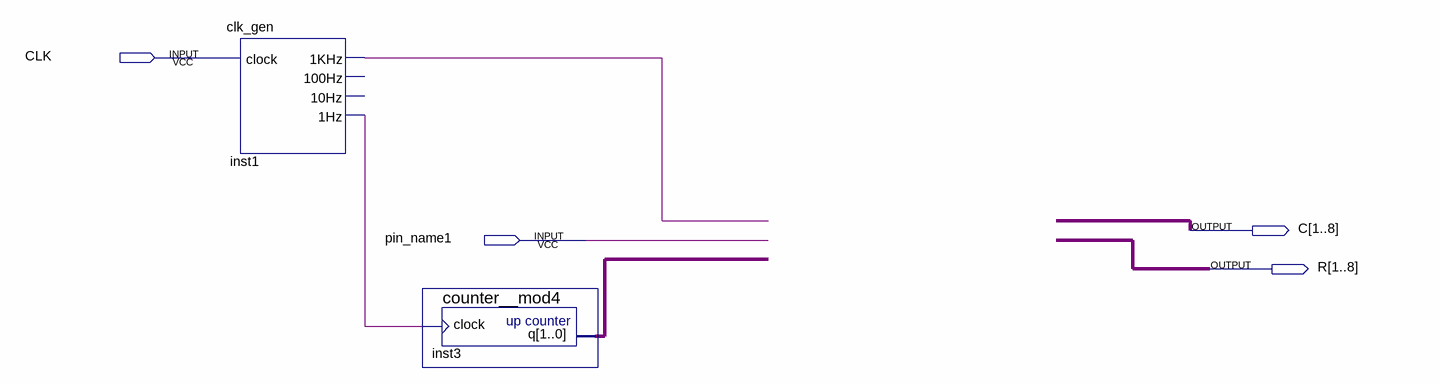
[diagram p0: schematic sheet]
// Quartus schematic test.bdf as structural Verilog: 2 symbols, 4 pins
module test (
  input  CLK,
  input  pin_name1,
  output [1:8] C,
  output [1:8] R
);

  wire inst1_1hz, inst1_1khz;
  wire [1:0] inst3_q;

  clk_gen inst1 (.clock(CLK), .\1KHz (inst1_1khz), .\1Hz (inst1_1hz));  // open: 100Hz, 10Hz
  counter__mod4 inst3 (.clock(inst1_1hz), .q(inst3_q));
endmodule
